# Altium project Digital_Optical_18Tx_14Tx4Rx_3vxx.PrjPCB
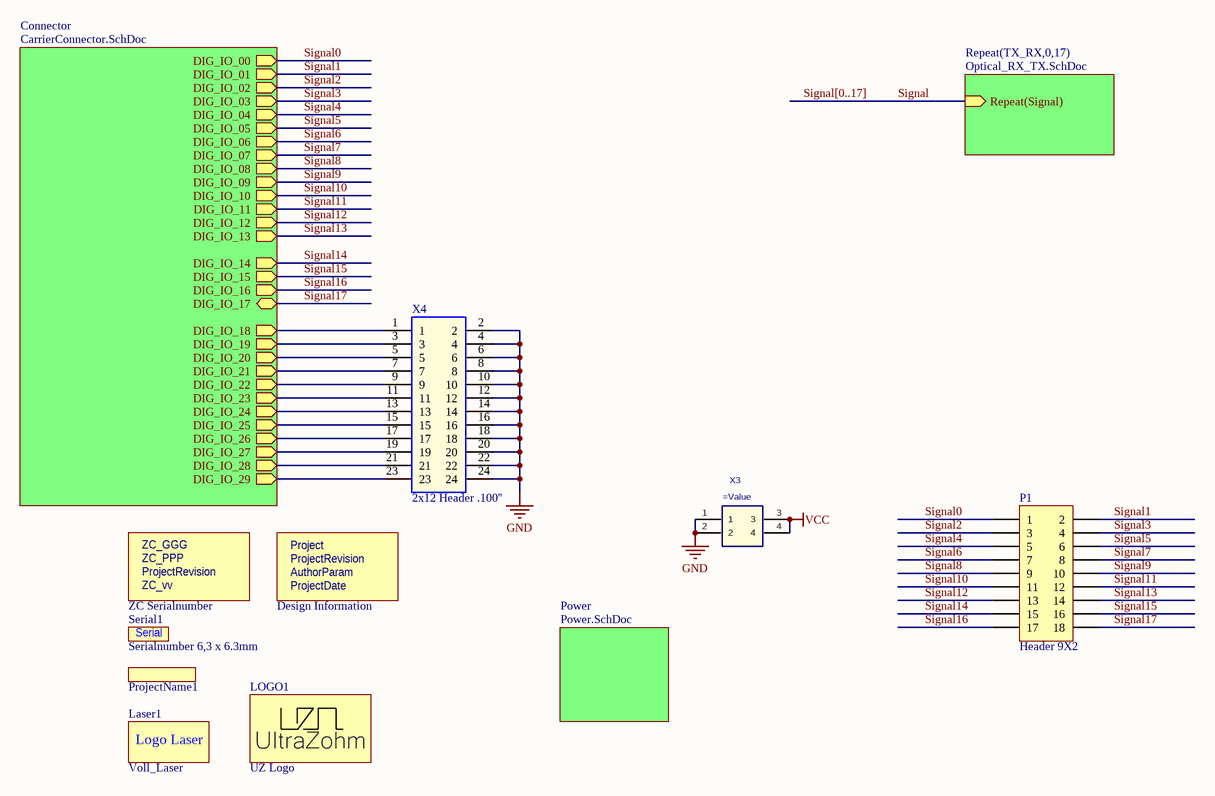
[diagram p0: TopSheet.SchDoc]
Author: T. Kreppel; Date: 04/20; ProjectName: Digital_Adapter_Optical_18Tx/14Tx_4Rx; ProjectRevision: 3v01
5 sheets, 66 parts. Net scope: hierarchical (ports join the sheet entries above them; power ports are global).
Board file: Digital_Optical_18Tx_14Tx4Rx_3vxx.PcbDoc
Sheets:
  TopSheet.SchDoc
    Power = Power.SchDoc
    Connector = CarrierConnector.SchDoc
  Optical_TX.SchDoc
  Optical_RX.SchDoc

## Sheet TopSheet.SchDoc
size A4; CompanyName: Technische Hochschule Nürnberg Georg Simon Ohm; Organization: UltraZohm; Address1: Kesslerplatz 12; Address2: 90489 Nürnberg; Address3: GERMANY; DocumentNumber: 1; SheetNumber: 1; SheetTotal: 5; Website: www.ultrazohm.com

### Parts
(Parts that share a designator on the sheet are numbered #1, #2 ... from top to bottom, then left to right.)
?#1  ZC Serialnumber  [ZC-Serial]  (no BOM)
?#2  Design Information  [Design_info2]  (no BOM)
Laser1  Voll_Laser  [Voll_Laser]  (no BOM)
LOGO1  UZ Logo  [UZ_Logo_small]  (no BOM)
P1  Header 9X2  [HDR2X9]
ProjectName1  Project Name, Rev  [ID_ProjectRev]  (value not drawn)  (no BOM)
Serial1  Serialnumber 6,3 x 6.3mm  [Serial_6.3x6.3mm]  (no BOM)
X3  (no value)  [IPL1-102-01-L-D-K]
X4  2x12 Header .100''  [TST-112-01-G-D]

### Sub-sheets
Connector = CarrierConnector.SchDoc: DIG_IO_05 (out), DIG_IO_09 (out), DIG_IO_01 (out), DIG_IO_07 (out), DIG_IO_08 (out), DIG_IO_06 (out), DIG_IO_04 (out), DIG_IO_16 (out), DIG_IO_12 (out), DIG_IO_15 (out), DIG_IO_02 (out), DIG_IO_03 (out), DIG_IO_11 (out), DIG_IO_14 (out), DIG_IO_13 (out), DIG_IO_10 (out), DIG_IO_27 (out), DIG_IO_26 (out), DIG_IO_17 (bidir), DIG_IO_19 (out), DIG_IO_29 (out), DIG_IO_24 (out), DIG_IO_22 (out), DIG_IO_28 (out), DIG_IO_21 (out), DIG_IO_23 (out), DIG_IO_25 (out), DIG_IO_18 (out), DIG_IO_20 (out), DIG_IO_00 (out)
Power = Power.SchDoc: no entries
Repeat(TX_RX,0,17) = Optical_RX_TX.SchDoc (file not in this document): Repeat(Signal) (in)

### Nets
GND: X3.1 X3.2 X4.2 X4.4 X4.6 X4.8 X4.10 X4.12 X4.14 X4.16 X4.18 X4.20 X4.22 X4.24
VCC: X3.3 X3.4
DIG_IO_18: X4.1 ; sheet Connector/DIG_IO_18
DIG_IO_19: X4.3 ; sheet Connector/DIG_IO_19
DIG_IO_20: X4.5 ; sheet Connector/DIG_IO_20
DIG_IO_21: X4.7 ; sheet Connector/DIG_IO_21
DIG_IO_22: X4.9 ; sheet Connector/DIG_IO_22
DIG_IO_23: X4.11 ; sheet Connector/DIG_IO_23
DIG_IO_24: X4.13 ; sheet Connector/DIG_IO_24
DIG_IO_25: X4.15 ; sheet Connector/DIG_IO_25
DIG_IO_26: X4.17 ; sheet Connector/DIG_IO_26
DIG_IO_27: X4.19 ; sheet Connector/DIG_IO_27
DIG_IO_28: X4.21 ; sheet Connector/DIG_IO_28
DIG_IO_29: X4.23 ; sheet Connector/DIG_IO_29
Signal: sheet Repeat(TX_RX,0,17)/Repeat(Signal)
Signal0: P1.1 ; sheet Connector/DIG_IO_00
Signal1: P1.2 ; sheet Connector/DIG_IO_01
Signal2: P1.3 ; sheet Connector/DIG_IO_02
Signal3: P1.4 ; sheet Connector/DIG_IO_03
Signal4: P1.5 ; sheet Connector/DIG_IO_04
Signal5: P1.6 ; sheet Connector/DIG_IO_05
Signal6: P1.7 ; sheet Connector/DIG_IO_06
Signal7: P1.8 ; sheet Connector/DIG_IO_07
Signal8: P1.9 ; sheet Connector/DIG_IO_08
Signal9: P1.10 ; sheet Connector/DIG_IO_09
Signal10: P1.11 ; sheet Connector/DIG_IO_10
Signal11: P1.12 ; sheet Connector/DIG_IO_11
Signal12: P1.13 ; sheet Connector/DIG_IO_12
Signal13: P1.14 ; sheet Connector/DIG_IO_13
Signal14: P1.15 ; sheet Connector/DIG_IO_14
Signal15: P1.16 ; sheet Connector/DIG_IO_15
Signal16: P1.17 ; sheet Connector/DIG_IO_16
Signal17: P1.18 ; sheet Connector/DIG_IO_17

### Buses and harness runs
bus Signal[0..17]

### Notes on the sheet
- Title
- Revision:
- Design Engineer:
- Date:
- Project:
- Sheet
- of
- (in symbol Design Information) Project; ProjectRevision; AuthorParam; ProjectDate
- (in symbol SerialNumber) Serial
- (in symbol Voll_Laser) Logo Laser
- (in symbol ZC-Serial) ZC_GGG; ZC_PPP; ProjectRevision; ZC_vv

### Library data of the parts
?#1 = ZC-Serial: Manufacturer: UltraZohm; Value: GGG-PPP-VVvv; Created from: FRosner; Manufacturer Part Number: ZC-Serial; PartID: 58; Created On: 15.04.2025 09:17:14; ComponentLink1Description: https://docs.ultrazohm.com/; ComponentLink1URL: homepage; Component Type: ZC Serialnumber; Last Updated: 15.04.2025 09:17:14; Supplier 1: -; Supplier Part Number 1: -; Type: Serial Number; Live Cycle Status: 1
?#2 = Design Information: Manufacturer: UltraZohm; Created from: MGremer; Manufacturer Part Number: Design Information; PartID: 12; Created On: 03.11.2021 09:04:23; ComponentLink1Description: https://docs.ultrazohm.com/; ComponentLink1URL: homepage; Component Type: Design Information; Last Updated: 15.04.2025 09:29:36; Supplier 1: -; Supplier Part Number 1: -; Type: Design Information; Value: Design Information; Live Cycle Status: 1
Laser1 = Voll_Laser: Logo Laser Warning Sign
LOGO1 = UZ Logo: UltraZohm Logo on PCB; Created: Jan2021_Liegmann; Value: UZ Logo
P1 = Header 9X2: Header, 9-Pin, Dual row; LatestRevisionDate: 17-Jul-2002; LatestRevisionNote: Re-released for DXP Platform.; Publisher: Altium Limited
ProjectName1 = ID_ProjectRev: Project Name and Revision Number; Created: 2018_11_23_AGeiger; Value: Project Name, Rev
Serial1 = SerialNumber: Created: 2018_09_18_AGeiger; Value: Serialnumber 6,3 x 6.3mm
X3 = IPL1-102-XX-X-D-X: 2.54mm Double Row Terminal Assembly, Right-Angled; Manufacturer: SAMTEC; Created: 2018_05_02_AGeiger; Value: =MPN; MPN: IPL1-102-01-L-D-K
X4 = TST-112-01-G-D: Double Row, 12 positions, Shrouded Terminal Header .100''; MF: Samtec; Created: 2020_04_Kreppel; MPN: TST-112-01-G-D; Supplier 1: Mouser; Supplier Part Number 1: 200-TST11201GD

## Sheet Power.SchDoc
size A4; CompanyName: Technische Hochschule Nürnberg Georg Simon Ohm; Organization: UltraZohm; Address1: Kesslerplatz 12; Address2: 90489 Nürnberg; Address3: GERMANY; DocumentNumber: 3; SheetNumber: 3; SheetTotal: 5; Website: www.ultrazohm.com
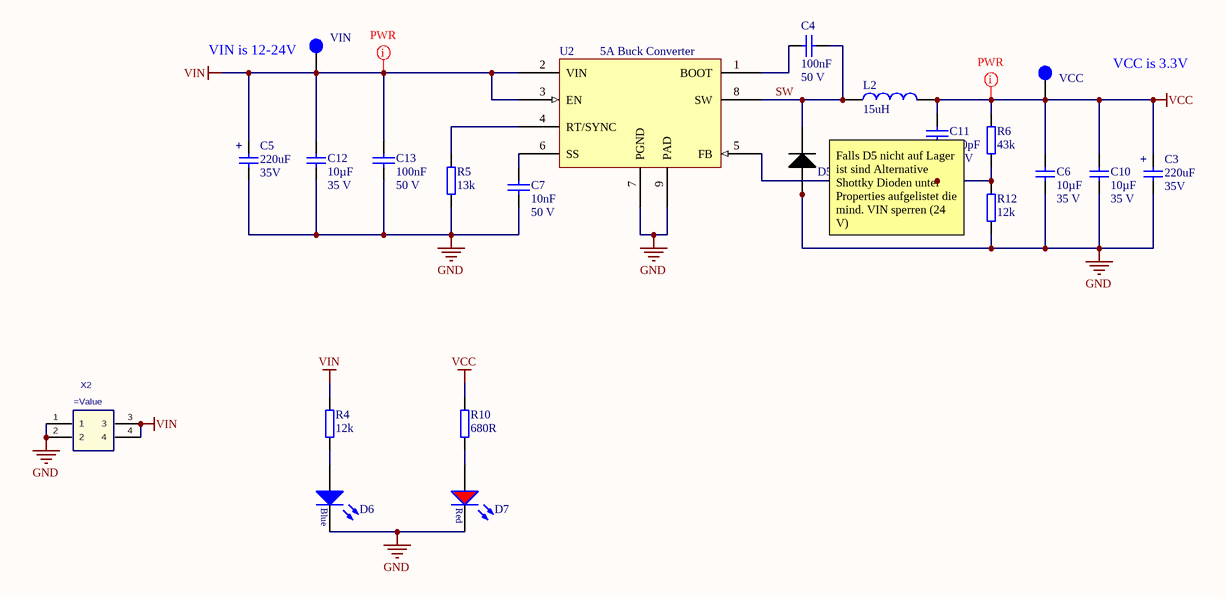
[diagram p1: Power.SchDoc]

### Parts
(Parts that share a designator on the sheet are numbered #1, #2 ... from top to bottom, then left to right.)
C3  220uF  Voltage: 35V  [CAPAE9083X105M]
C4  Rated Voltage: 50 V  [C_0603(1608)100_L]  (hidden comment: 100nF)
C5  220uF  Voltage: 35V  [CAPAE9083X105M]
C6  10µF  Voltage: 35 V  [C_1206]
C7  Rated Voltage: 50 V  [C_0603(1608)100_L]  (hidden comment: 10nF)
C10  10µF  Voltage: 35 V  [C_1206]
C11  Rated Voltage: 50 V  [C_0603(1608)100_L]  (hidden comment: 220pF)
C12  10µF  Voltage: 35 V  [C_1206]
C13  Rated Voltage: 50 V  [C_0603(1608)100_L]  (hidden comment: 100nF)
D5  (no value)  [DPAK254P1542X460-3N]
D6  150060BS75000  [WL-SMCW_0603]  (value not drawn)
D7  150060RS75000  [WL-SMCW_0603]  (value not drawn)
L2  15uH  [MWSA1004]
R4  12k  [R_0603_N]
R5  13k  [R_0603_N]
R6  43k  [R_0603_N]
R10  680R  [R_0603_N]
R12#1  12k  [R_0603_N]
U2  5A Buck Converter  [SOP127P600X170_HS-9N]
VCC  Testpoint 1mm  [TP_1mm]  (value not drawn)  (no BOM)
VIN  Testpoint 1mm  [TP_1mm]  (value not drawn)  (no BOM)
X2  (no value)  [IPL1-102-01-L-D-K]

### Nets
GND: C3.2 C5.2 C6.1 C7.2 C10.1 C12.1 C13.1 D5.1(A) D5.3(A) D6.1(K) D7.1(K) R5.1 R12#1.1 U2.7(PGND) U2.9(PAD) X2.1 X2.2
VCC: C3.1 C6.2 C10.2 C11.1 L2.2 R6.2 R10.2 VCC.1
VIN: C5.1 C12.2 C13.2 R4.2 U2.2(VIN) U2.3(EN) VIN.1 X2.3 X2.4
SW: C4.2 D5.4(K) L2.1 U2.8(SW)
NetC4_1: C4.1 U2.1(BOOT)
NetC7_1: C7.1 U2.6(SS)
NetC11_2: C11.2 R6.1 R12#1.2 U2.5(FB)
NetD6_2: D6.2(A) R4.1
NetD7_2: D7.2(A) R10.1
NetR5_2: R5.2 U2.4(RT/SYNC)

### Layout directives
mark named PWR: VCC, VIN

### Notes on the sheet
- (near VIN) VIN is 12-24V
- VCC is 3.3V
- (near C11) Falls D5 nicht auf Lager ist sind Alternative Shottky Dioden unter Properties aufgelistet die mind. VIN sperren (24 V)
- Title
- Revision:
- Design Engineer:
- Date:
- Project:
- Sheet
- of
- (in symbol C_ELKO_8x10) +

### Library data of the parts
C3 C5 = C_ELKO_8x10: ALUMINUM ELECTROLYTIC CAPACITOR; MPN: tbd; Tolerance: 20%; Package: 8x10; Value: 220uF; Created: 2018_06_25_AGeiger; Supplier Part Number 1: tbd; LCSC Part #: C311611; Dielectric: tbd; Supplier 1: tbd
C4 C7 C11 C13 = C_0603: CAP 0603 (1608 Metric) SMD; Tolerance: ±5%; Case-Metric: 1608; Case-EIA: 0603; Max Thickness: 1 mm; Technology: SMT; Created: 2018_09_06_AGeiger; Dielectric: *; Supplier 1: *; Supplier Part Number 1: *; MF: *; MPN: *; Package: 0603
  C4 C13: LCSC Part #: C14663; Value: 100nF
  C7: LCSC Part #: C57112; Value: 10nF
  C11: LCSC Part #: C1603; Value: 220pF
C6 C10 C12 = C_1206: Capacitor 1206; MPN: GMK316BJ106KL-T; Tolerance: 10%; MF: Taiyo Yuden; Dielectric: X5R; Package: 1206; Value: 10µF; Created: 2018_06_25_AGeiger; Supplier 1: Mouser; Supplier Part Number 1: 963-GMK316BJ106KL-T; LCSC Part #: C13585
D5 = STPS30L60CG-TR: SCHOTTKY BARRIER DIODES (SBD) TO-263-2 ROHS; ComponentLink1Description: Manufacturer; ComponentLink1URL: STMicroelectronics; ComponentLink2Description: Datasheet; LCSC Part # 4: C213442; LCSC Part # 2: C172486; LCSC Part # 3: C180216; LCSC Part #: C181026
D6 = LED_Blue_0603: WL-SMCW SMD Mono-color Chip LED Waterclear, size 0603, Blue, 3.2 V, 140°; Forward Voltage: 3.2 V; Luminous Intensity: 145 mcd; Peak Wavelength: 465 nm; Dominant Wavelength: 470 nm; MF: Wuerth Elektronik; Published Date: Sep. 2017; ComponentLink1Description: Manufacturer; ComponentLink1URL: http://www.we-online.de; ComponentLink2Description: Datasheet; ComponentLink2URL: http://katalog.we-online.com/led/datasheet/150060BS75000.pdf; MPN: 150060BS75000; Size: 0603; Viewing Angle: 140°; Emitting Color: Blue; Value: 150060BS75000; Package: 0603; Created: 2018_09_06_AGeiger; Supplier 1: Farnell; Supplier Part Number 1: 2322069; Supplier 2: Mouser; Supplier Part Number 2: 710-150060BS75000; Supplier 3: Digi-Key; Supplier Part Number 3: 732-4966-1-ND; LCSC Part #: C72041
D7 = LED_Red_0603: WL-SMCW SMD Mono-color Chip LED Waterclear, size 0603, Red, 2 V, 140°; Forward Voltage: 2 V; Luminous Intensity: 250 mcd; Peak Wavelength: 630 nm; Dominant Wavelength: 625 nm; MF: Wuerth Elektronik; Published Date: Sep. 2017; ComponentLink1Description: Manufacturer; ComponentLink1URL: http://www.we-online.de; ComponentLink2Description: Datasheet; ComponentLink2URL: http://katalog.we-online.com/led/datasheet/150060RS75000.pdf; MPN: 150060RS75000; Size: 0603; Viewing Angle: 140°; Emitting Color: Red; Value: 150060RS75000; Package: 0603; Created: 2018_09_06_AGeiger; Supplier 1: Farnell; Supplier Part Number 1: 2322071; Supplier 2: Mouser; Supplier Part Number 2: 710-150060RS75000; Supplier 3: Digi-Key; Supplier Part Number 3: 732-4978-1-ND; LCSC Part #: C2286
L2 = Inductor_2.2uH_13A: POWER INDUCTORS 2.2UH ±20% 13A SMD,10.5X11.5X4.0MM ROHS; Current rated: 6.25A; Value2: 2.2uH; LCSC Part2 #: C149550; Current rated2: 13A; LCSC Part #: C151872; Value: 15uH
R4-R6 R12#1 = R_0603_JLC: SMD Resistor 0603; Tolerance: 1%; Voltage: 50V; Power: 100 mW; Package: 0603; Created: 2018_09_06_AGeiger; Supplier 1: *; Supplier Part Number 1: *
  R4 R12#1: Value: 12k; LCSC Part #: C22790
  R5: Value: 13k; LCSC Part #: C22797
  R6: Value: 43k; LCSC Part #: C23172
R10 = R_0603: SMD Resistor 0603; MPN: CR0603-FX-3901ELF; Tolerance: 1%; Voltage: 75V; Power: 100 mW; MF: Bourns; Package: 0603; Value: 680R; Created: 2018_09_06_AGeiger; Supplier 1: Mouser; Supplier Part Number 1: 652-CR0603-FX3901ELF; LCSC Part #: C23228
U2 = LMR14050: SIMPLE SWITCHER® 40-V, 5-A, 2.2-MHz step-down converter with 40-μA IQr; MPN: LMR14050SDDAR; MF: Texas Instruments; fSW: 1 MHz; Created: 2020_04_Kreppel; Package: HSOIC-8; Supplier 1: Mouser; Supplier Part Number 1: 595-LMR14050SDDAR; LCSC Part #: C155484
VCC VIN = TP_1mm: Created: 2018_06_25_AGeiger; Value: Testpoint 1mm
X2 = IPL1-102-XX-X-D-X: as X3 on sheet TopSheet; Created: 2018_05_02_AGeiger; Value: =MPN; MPN: IPL1-102-01-L-D-K

## Sheet CarrierConnector.SchDoc
size A4; CompanyName: Technische Hochschule Nürnberg Georg Simon Ohm; Organization: UltraZohm; Address1: Kesslerplatz 12; Address2: 90489 Nürnberg; Address3: GERMANY; DocumentNumber: 2; SheetNumber: 2; SheetTotal: 5; Website: www.ultrazohm.com
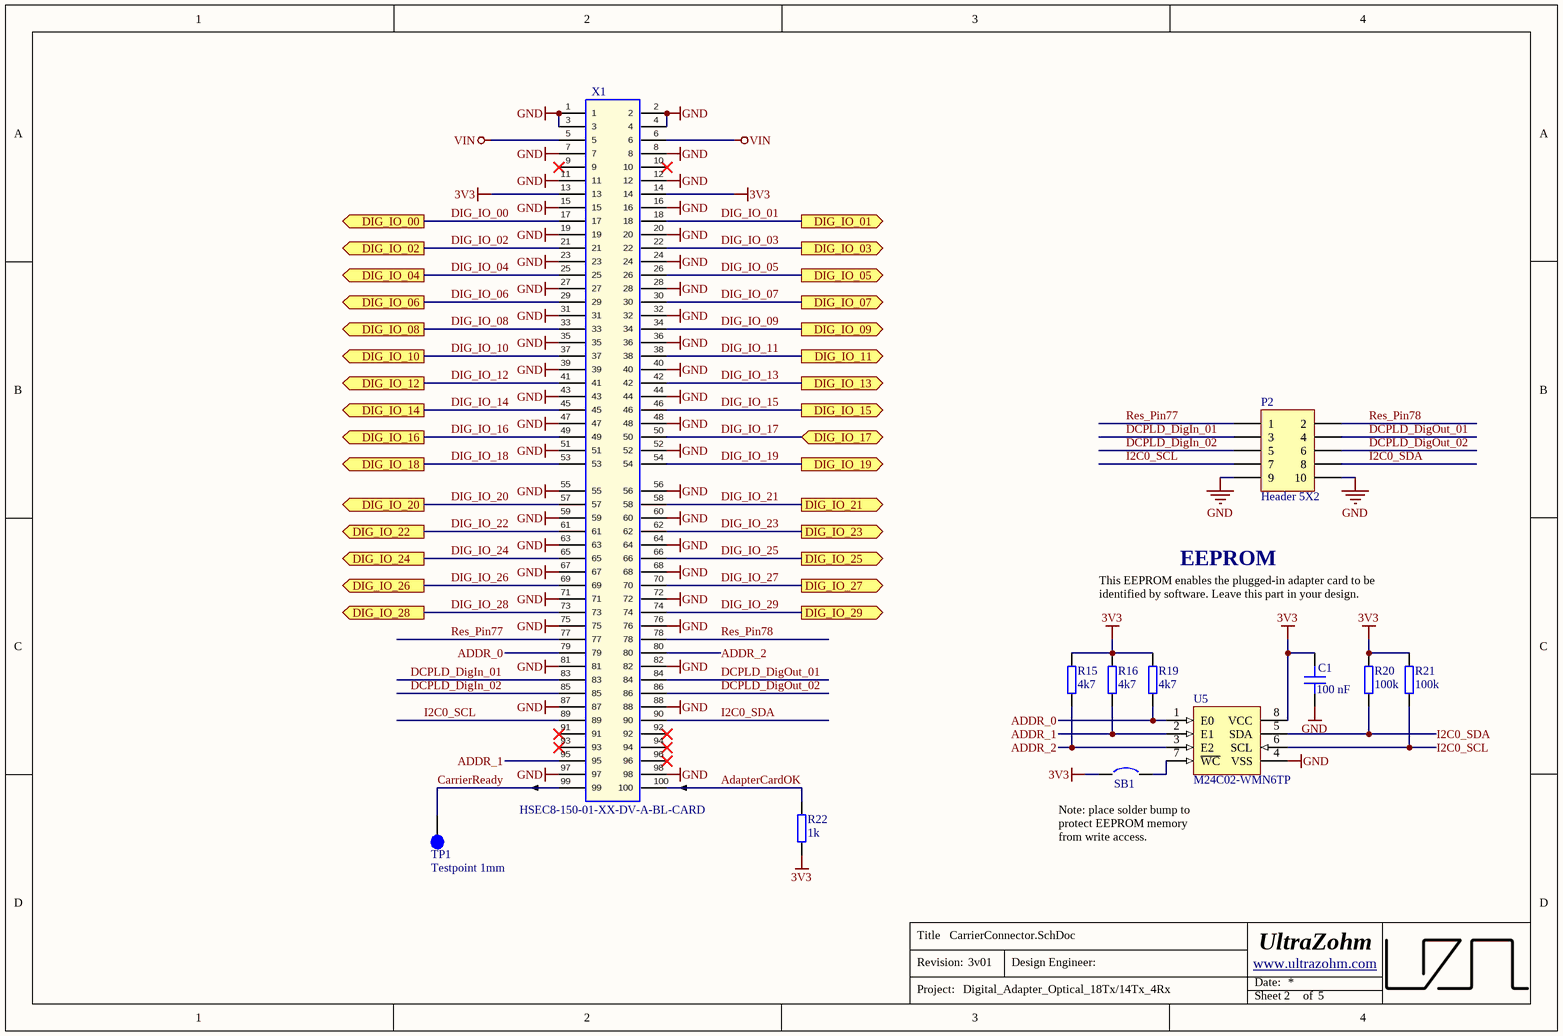
[diagram p2: CarrierConnector.SchDoc]

### Parts
(Parts that share a designator on the sheet are numbered #1, #2 ... from top to bottom, then left to right.)
C1#1  100 nF  [C_0603]
P2  Header 5X2  [HDR2X5]
R15  4k7  [RES 0603_1608]
R16  4k7  [RES 0603_1608]
R19  4k7  [RES 0603_1608]
R20  100k  [RES 0603_1608]
R21  100k  [RES 0603_1608]
R22  1k  [R_0603_TE]
SB1  Solder Bump 0603  [SB_0603]  (value not drawn)  (no BOM)
TP1  Testpoint 1mm  [TP_1mm]  (no BOM)
U5#1  M24C02-WMN6TP  [D0008A_N]
X1  HSEC8-150-01-XX-DV-A-BL-CARD  [HSEC8-150-01-XX-DV-A-BL-CARD]  (no BOM)

### Ports
DIG_IO_00 (out), DIG_IO_01 (out), DIG_IO_02 (out), DIG_IO_03 (out), DIG_IO_04 (out), DIG_IO_05 (out), DIG_IO_06 (out), DIG_IO_07 (out), DIG_IO_08 (out), DIG_IO_09 (out), DIG_IO_10 (out), DIG_IO_11 (out), DIG_IO_12 (out), DIG_IO_13 (out), DIG_IO_14 (out), DIG_IO_15 (out), DIG_IO_16 (out), DIG_IO_17 (bidir), DIG_IO_18 (out), DIG_IO_19 (out), DIG_IO_20 (out), DIG_IO_21 (out), DIG_IO_22 (out), DIG_IO_23 (out), DIG_IO_24 (out), DIG_IO_25 (out), DIG_IO_26 (out), DIG_IO_27 (out), DIG_IO_28 (out), DIG_IO_29 (out)

### Nets
3V3: C1#1.1 R15.2 R16.2 R19.2 R20.2 R21.2 R22.1 SB1.1 U5#1.8(VCC) X1.13 X1.14
GND: C1#1.2 P2.9 P2.10 U5#1.4(VSS) X1.1 X1.2 X1.3 X1.4 X1.7 X1.8 X1.11 X1.12 X1.15 X1.16 X1.19 X1.20 X1.23 X1.24 X1.27 X1.28 X1.31 X1.32 X1.35 X1.36 X1.39 X1.40 X1.43 X1.44 X1.47 X1.48 X1.51 X1.52 X1.55 X1.56 X1.59 X1.60 X1.63 X1.64 X1.67 X1.68 X1.71 X1.72 X1.75 X1.76 X1.81 X1.82 X1.87 X1.88 X1.97 X1.98
VIN: X1.5 X1.6
AdapterCardOK: R22.2 X1.100
ADDR_0: R19.1 U5#1.1(E0) X1.79
ADDR_1: R16.1 U5#1.2(E1) X1.95
ADDR_2: R15.1 U5#1.3(E2) X1.80
CarrierReady: TP1.1 X1.99
DCPLD_DigIn_01: P2.3 X1.83
DCPLD_DigIn_02: P2.5 X1.85
DCPLD_DigOut_01: P2.4 X1.84
DCPLD_DigOut_02: P2.6 X1.86
DIG_IO_00: X1.17 ; port DIG_IO_00  [project net Signal0]
DIG_IO_01: X1.18 ; port DIG_IO_01  [project net Signal1]
DIG_IO_02: X1.21 ; port DIG_IO_02  [project net Signal2]
DIG_IO_03: X1.22 ; port DIG_IO_03  [project net Signal3]
DIG_IO_04: X1.25 ; port DIG_IO_04  [project net Signal4]
DIG_IO_05: X1.26 ; port DIG_IO_05  [project net Signal5]
DIG_IO_06: X1.29 ; port DIG_IO_06  [project net Signal6]
DIG_IO_07: X1.30 ; port DIG_IO_07  [project net Signal7]
DIG_IO_08: X1.33 ; port DIG_IO_08  [project net Signal8]
DIG_IO_09: X1.34 ; port DIG_IO_09  [project net Signal9]
DIG_IO_10: X1.37 ; port DIG_IO_10  [project net Signal10]
DIG_IO_11: X1.38 ; port DIG_IO_11  [project net Signal11]
DIG_IO_12: X1.41 ; port DIG_IO_12  [project net Signal12]
DIG_IO_13: X1.42 ; port DIG_IO_13  [project net Signal13]
DIG_IO_14: X1.45 ; port DIG_IO_14  [project net Signal14]
DIG_IO_15: X1.46 ; port DIG_IO_15  [project net Signal15]
DIG_IO_16: X1.49 ; port DIG_IO_16  [project net Signal16]
DIG_IO_17: X1.50 ; port DIG_IO_17  [project net Signal17]
DIG_IO_18: X1.53 ; port DIG_IO_18
DIG_IO_19: X1.54 ; port DIG_IO_19
DIG_IO_20: X1.57 ; port DIG_IO_20
DIG_IO_21: X1.58 ; port DIG_IO_21
DIG_IO_22: X1.61 ; port DIG_IO_22
DIG_IO_23: X1.62 ; port DIG_IO_23
DIG_IO_24: X1.65 ; port DIG_IO_24
DIG_IO_25: X1.66 ; port DIG_IO_25
DIG_IO_26: X1.69 ; port DIG_IO_26
DIG_IO_27: X1.70 ; port DIG_IO_27
DIG_IO_28: X1.73 ; port DIG_IO_28
DIG_IO_29: X1.74 ; port DIG_IO_29
I2C0_SCL: P2.7 R21.1 U5#1.6(SCL) X1.89
I2C0_SDA: P2.8 R20.1 U5#1.5(SDA) X1.90
Res_Pin77: P2.1 X1.77
Res_Pin78: P2.2 X1.78
NetSB1_2: SB1.2 U5#1.7(~{WC})

Not connected (* = marked no-connect by the designer): X1 9* 10* 91* 92* 93* 94* 96*

### Notes on the sheet
- EEPROM
- This EEPROM enables the plugged-in adapter card to be identified by software. Leave this part in your design.
- Note: place solder bump to protect EEPROM memory from write access.
- Title
- Revision:
- Design Engineer:
- Date:
- Project:
- Sheet
- of

### Library data of the parts
C1#1 = C0603C104K9PACTU: Capacitor 0603, 6.3 VDC, 100 nF, X5R; Manufacturer: KEMET; Tolerance: 10 %; Voltage Rating: 6.3 VDC; Created from: MGremer; Manufacturer Part Number: C0603C104K9PACTU; PartID: 70; Created On: 20.12.2020 13:54:13; ComponentLink1Description: Datasheet; ComponentLink1URL: https://www.mouser.de/datasheet/2/212/KEM_C1006_X5R_SMD-1103249.pdf; Component Type: Capacitor 0603; Device Package: 0603; Last Updated: 20.01.2021 13:57:36; Mounting Type: SMD; Operating Temperature: -55 - 85°C; Series: SMD Comm X5R; Supplier 1: Mouser; Supplier Part Number 1: 80-C0603C104K9P; Type: Capacitor; Value: 100 nF; Live Cycle Status: 1; Stock number: not stored
P2 = Header 5X2: Header, 5-Pin, Dual row; LatestRevisionDate: 17-Jul-2002; LatestRevisionNote: Re-released for DXP Platform.; Publisher: Altium Limited
R15 R16 R19 = 0603WAF4701T5E: SMD resistor E24 series; Manufacturer: UNI-ROYAL; Tolerance: 1%; Created from: AGeiger; Manufacturer Part Number: 0603WAF4701T5E; PartID: 90; Created On: 14.12.2020 16:17:14; ComponentLink1Description: Datasheet; ComponentLink1URL: https://datasheet.lcsc.com/lcsc/2206010116_UNI-ROYAL-Uniroyal-Elec-0603WAF4701T5E_C23162.pdf; Component Type: SMD resistor; Device Package: 0603; Last Updated: 25.08.2022 20:03:04; Mounting Type: SMD; Supplier 1: LCSC; Supplier Part Number 1: C23162; Type: Resistor; Value: 4k7; Live Cycle Status: 1; Stock number: Labor SMD Container; LCSC Part Number: C23162
R20 R21 = RK73B1JTTD104J: SMD resistor E24 series; Manufacturer: KOA Speer; Tolerance: 5%; Created from: MGremer; Manufacturer Part Number: RK73B1JTTD104J; PartID: 122; Created On: 14.12.2020 16:17:14; ComponentLink1Description: Datasheet; ComponentLink1URL: https://www.mouser.de/datasheet/2/219/RK73B-1825463.pdf; Component Type: SMD resistor; Device Package: 0603; Last Updated: 27.05.2022 14:04:10; Mounting Type: SMD; Supplier 1: Mouser; Supplier Part Number 1: 660-RK73B1JTTD104J; Type: Resistor; Value: 100k; Live Cycle Status: 1; Stock number: Labor SMD Container; LCSC Part Number: C25803
R22 = UZgen_R_0603_1k: Generic resistor; Manufacturer: UZgen; Tolerance: 1 %; Created from: UZgenTool; Manufacturer Part Number: UZgen_R_0603_1k; PartID: 221; Created On: 02.07.2024 17:29:49; Value: 1k; Device Package: 0603; Mounting Type: SMD; Last Updated: 02.07.2024 17:29:49
SB1 = =Value: Created from: AGeiger; Revision: July-2002: Re-released for DXP Platform.; PartID: 1; Created On: 09.01.2024 17:13:56; Component Type: Solder Bump; Device Package: 0603; Last Updated: 09.01.2024 17:13:56; Manufacturer Part Number: Solder Bump 0603; Mounting Type: SMD; Value: Solder Bump 0603
TP1 = NULL: Manufacturer Part Number: NULL; Created from: AGeiger; Created: 2018_06_25_AGeiger; Value: Testpoint 1mm; PartID: 9; Created On: 20.09.2022 13:14:57; Component Type: Testpoint; Last Updated: 20.09.2022 13:15:39; Manufacturer: NULL; Supplier 1: NULL; Supplier Part Number 1: NULL; Type: Testpoint; Live Cycle Status: 1
U5#1 = M24C02-WMN6TP: 2Kbit I2C SOP-8 EEPROM ROHS; Manufacturer: STMicroelectronics; Created from: AGeiger; Manufacturer Part Number: M24C02-WMN6TP; PartID: 1; Created On: 19.11.2023 14:54:27; ComponentLink1Description: Datasheet; ComponentLink1URL: https://www.st.com/resource/en/datasheet/m24c01-w.pdf; Component Type: EEPROM; Device Package: SOIC-8; Last Updated: 19.11.2023 21:39:04; Mounting Type: SMD; Operating Temperature: -40 to +85 °C; Series: M24xxx; Supplier 1: Mouser; Supplier Part Number 1: 511-M24C02-WMN6TP; Supplier 2: LCSC; Supplier Part Number 2: C7562; Type: Memory; Value: M24C02-WMN6TP; LCSC Part Number: C7562
X1 = HSEC8-150-01-XX-DV-A-BL-CARD: Mating Card Layout for HSEC8-150-01-XX-DV-A-BL; Manufacturer: SAMTEC; Created: 2018_04_23_AGeiger; Value: HSEC8-150-01-XX-DV-A-BL-CARD

## Sheet Optical_TX.SchDoc
size A4; CompanyName: Technische Hochschule Nürnberg Georg Simon Ohm; Organization: UltraZohm; Address1: Kesslerplatz 12; Address2: 90489 Nürnberg; Address3: GERMANY; DocumentNumber: 4; SheetNumber: 4; SheetTotal: 5; Website: www.ultrazohm.com
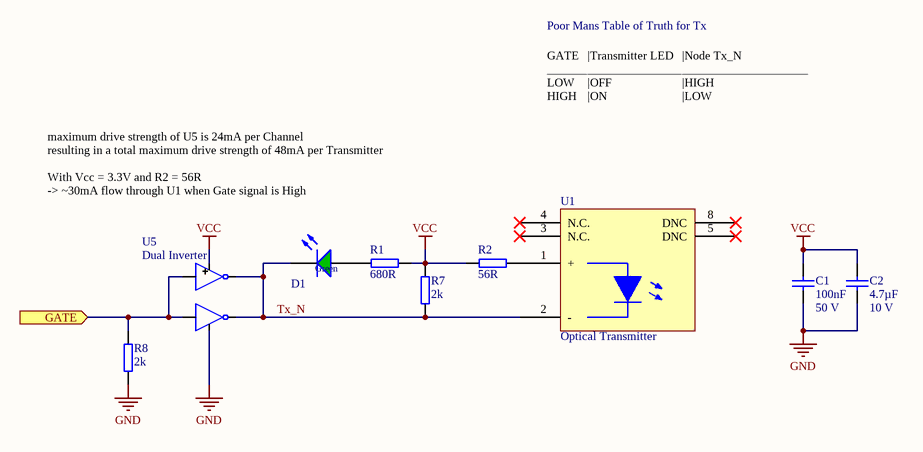
[diagram p3: Optical_TX.SchDoc]

### Parts
(Parts that share a designator on the sheet are numbered #1, #2 ... from top to bottom, then left to right.)
C1#2  Rated Voltage: 50 V  [C_0603(1608)100_L]  (hidden comment: 100nF)
C2  Voltage: 10 V  [CAP_2012X06N]  (hidden comment: 4.7µF)
D1  150060GS75000  [WL-SMCW_0603]  (value not drawn)
R1  680R  [R_0603_N]
R2  56R  [RES_2012X06N]
R7  2k  [R_0603_N]
R8  2k  [R_0603_N]
U1  Optical Transmitter  [HFBRx5XX]
U5#2  Dual Inverter  [SN74LVC2GU04DCKR]

### Ports
GATE (in)

### Nets
GND: C1#2.2 C2.2 R8.1 U5#2.2(GND)
VCC: C1#2.1 C2.1 R1.2 R2.1 R7.2 U5#2.5(VCC)
Tx_N: D1.1(K) R7.1 U1.2(-) U5#2.4(OUT2) U5#2.6(OUT2)
NetD1_2: D1.2(A) R1.1
NetR2_2: R2.2 U1.1(+)
NetR8_2: R8.2 U5#2.1(IN1) U5#2.3(IN2) ; port GATE

Not connected (* = marked no-connect by the designer): U1 3(N.C.)* 4(N.C.)* 5(DNC)* 8(DNC)*

### Notes on the sheet
- Poor Mans Table of Truth for Tx
- GATE
  _______
  LOW
  HIGH
- |Transmitter LED
  ___________________
  |OFF
  |ON
- |Node Tx_N
  _____________________
  |HIGH
  |LOW
- maximum drive strength of U5 is 24mA per Channel
  resulting in a total maximum drive strength of 48mA per Transmitter
  With Vcc = 3.3V and R2 = 56R
  -> ~30mA flow through U1 when Gate signal is High
- Title
- Revision:
- Design Engineer:
- Date:
- Project:
- Sheet
- of

### Library data of the parts
C1#2 = C_0603: as C4 on sheet Power; Max Thickness: 1 mm; Technology: SMT; Created: 2018_09_06_AGeiger; Dielectric: *; Supplier 1: *; Supplier Part Number 1: *; MF: *; MPN: *; Value: 100nF; Package: 0603; LCSC Part #: C14663
C2 = C_0805: CAP 0805 (2012 Metric) SMD; MPN: LMF212B7475KGHT; Tolerance: ±10%; Case-Metric: 2012; Dielectric: X7R; MF: Taiyo Yuden; Case-EIA: 0805; Max Thickness: 1 mm; Technology: SMT; Created: 2018_09_06_AGeiger; Supplier 1: Mouser; Supplier Part Number 1: 963-LMF212B7475KGHT; Value: 4.7µF; Package: 0805; LCSC Part #: C1779
D1 = LED_Green_0603: WL-SMCW SMD Mono-color Chip LED Waterclear, size 0603, Green, 3.2 V, 140°; Forward Voltage: 3.2 V; Luminous Intensity: 430 mcd; Peak Wavelength: 515 nm; Dominant Wavelength: 520 nm; MF: Wuerth Elektronik; Published Date: Sep. 2017; ComponentLink1Description: Manufacturer; ComponentLink1URL: http://www.we-online.de; ComponentLink2Description: Datasheet; ComponentLink2URL: http://katalog.we-online.com/led/datasheet/150060GS75000.pdf; MPN: 150060GS75000; Size: 0603; Viewing Angle: 140°; Emitting Color: Green; Value: 150060GS75000; Package: 0603; Created: 2018_09_06_AGeiger; Supplier 1: Farnell; Supplier Part Number 1: 2322070; Supplier 2: Mouser; Supplier Part Number 2: 710-150060GS75000; Supplier 3: Digi-Key; Supplier Part Number 3: 732-4971-1-ND; LCSC Part #: C72043
R1 = R_0603: as R10 on sheet Power; Package: 0603; Value: 680R; Created: 2018_09_06_AGeiger; Supplier 1: Mouser; Supplier Part Number 1: 652-CR0603-FX3901ELF; LCSC Part #: C23228
R2 = R_0805: SMD Resistor 0805; Case_EIA: 0805; MF: Bourns; Voltage: 150 V; Power: 125 mW; Tolerance: 1%; Value: 56R; Supplier 1: Mouser; LCSC Part #: C17757
R7 R8 = R_0603: SMD Resistor 0603; MPN: RC0603FR-072KL; Tolerance: 1%; Voltage: 75 V; Power: 100 mW; MF: Yageo; Package: 0603; Value: 2k; Created: 2018_09_06_AGeiger; Supplier 1: Mouser; Supplier Part Number 1: 603-RC0603FR-072KL; LCSC Part #: C22975
U1 = HFBR-1521Z: Fibre Optic Transmitters, Link Horiz 5MBd Tx RoHS; MF: Broadcom/Avago; Wavelength: 660 nm; Foreward Current: 60 mA; Supply Voltage: 5V; Created: 2019_04_09_Kreppel; MPN: HFBR-1521Z; Data Rate: 5 MBd; Supplier 1: Mouser; Supplier 2: Digi-Key; Supplier Part Number 1: 630-HFBR-1521Z; Supplier Part Number 2: 516-2043-ND
U5#2 = SN74LVC2GU04DCKR: This dual inverter is designed for 1.65-V to 5.5-V VCC / operation.; LCSC Part #: C116660; JLCSMT Rotation: 180

## Sheet Optical_RX.SchDoc
size A4; CompanyName: Technische Hochschule Nürnberg Georg Simon Ohm; Organization: UltraZohm; Address1: Kesslerplatz 12; Address2: 90489 Nürnberg; Address3: GERMANY; DocumentNumber: 5; SheetNumber: 5; SheetTotal: 5; Website: www.ultrazohm.com
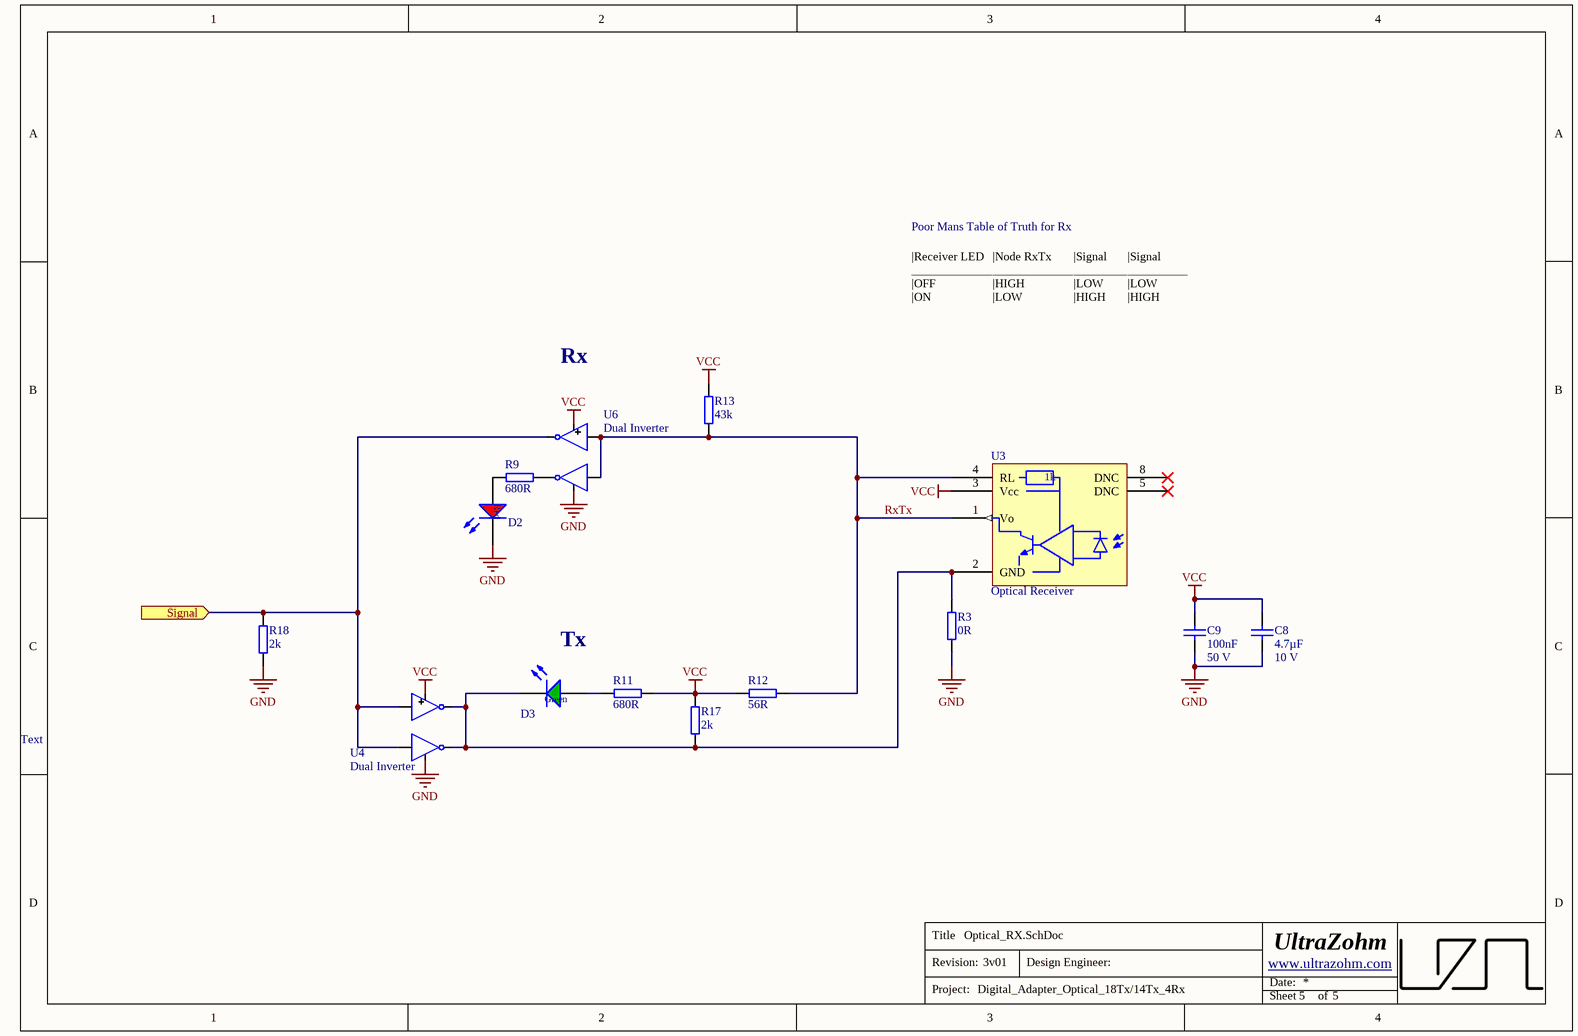
[diagram p4: Optical_RX.SchDoc]

### Parts
(Parts that share a designator on the sheet are numbered #1, #2 ... from top to bottom, then left to right.)
C8  Voltage: 10 V  [CAP_2012X06N]  (hidden comment: 4.7µF)
C9  Rated Voltage: 50 V  [C_0603(1608)100_L]  (hidden comment: 100nF)
D2  150060RS75000  [WL-SMCW_0603]  (value not drawn)
D3  150060GS75000  [WL-SMCW_0603]  (value not drawn)
R3  0R  [R_0603_N]
R9  680R  [R_0603_N]
R11  680R  [R_0603_N]
R12#2  56R  [RES_2012X06N]
R13  43k  [R_0603_N]
R17  2k  [R_0603_N]
R18  2k  [R_0603_N]
U3  Optical Receiver  [HFBRx5XX]
U4  Dual Inverter  [SN74LVC2GU04DCKR]
U6  Dual Inverter  [SN74LVC2GU04DCKR]

### Ports
Signal (in)

### Nets
GND: C8.2 C9.2 D2.1(K) R3.2 R18.1 U4.2(GND) U6.2(GND)
VCC: C8.1 C9.1 R11.1 R12#2.1 R13.1 R17.2 U3.3(Vcc) U4.5(VCC) U6.5(VCC)
RxTx: R12#2.2 R13.2 U3.1(Vo) U3.4(RL) U6.1(IN1) U6.3(IN2)
NetD2_2: D2.2(A) R9.2
NetD3_1: D3.1(K) R3.1 R17.1 U3.2(GND) U4.4(OUT2) U4.6(OUT2)
NetD3_2: D3.2(A) R11.2
NetR9_1: R9.1 U6.4(OUT2)
NetR18_2: R18.2 U4.1(IN1) U4.3(IN2) U6.6(OUT2) ; port Signal

Not connected (* = marked no-connect by the designer): U3 5(DNC)* 8(DNC)*

### Notes on the sheet
- Poor Mans Table of Truth for Rx
- |Receiver LED
  ________________
  |OFF
  |ON
- |Node RxTx
  _________________
  |HIGH
  |LOW
- |Signal
  _______________
  |LOW
  |HIGH
- GATE
  _______
  LOW
  HIGH
- |Signal
  __________
  |LOW
  |HIGH
- Rx
- Tx
- Text
- Title
- Revision:
- Design Engineer:
- Date:
- Project:
- Sheet
- of
- (in symbol HFBR-2528Z) 1k

### Library data of the parts
C8 = C_0805: as C2 on sheet Optical_TX; Max Thickness: 1 mm; Technology: SMT; Created: 2018_09_06_AGeiger; Supplier 1: Mouser; Supplier Part Number 1: 963-LMF212B7475KGHT; Value: 4.7µF; Package: 0805; LCSC Part #: C1779
C9 = C_0603: as C4 on sheet Power; Max Thickness: 1 mm; Technology: SMT; Created: 2018_09_06_AGeiger; Dielectric: *; Supplier 1: *; Supplier Part Number 1: *; MF: *; MPN: *; Value: 100nF; Package: 0603; LCSC Part #: C14663
D2 = LED_Red_0603: as D7 on sheet Power; Published Date: Sep. 2017; ComponentLink1Description: Manufacturer; ComponentLink1URL: http://www.we-online.de; ComponentLink2Description: Datasheet; ComponentLink2URL: http://katalog.we-online.com/led/datasheet/150060RS75000.pdf; MPN: 150060RS75000; Size: 0603; Viewing Angle: 140°; Emitting Color: Red; Value: 150060RS75000; Package: 0603; Created: 2018_09_06_AGeiger; Supplier 1: Farnell; Supplier Part Number 1: 2322071; Supplier 2: Mouser; Supplier Part Number 2: 710-150060RS75000; Supplier 3: Digi-Key; Supplier Part Number 3: 732-4978-1-ND; LCSC Part #: C2286
D3 = LED_Green_0603: as D1 on sheet Optical_TX; Published Date: Sep. 2017; ComponentLink1Description: Manufacturer; ComponentLink1URL: http://www.we-online.de; ComponentLink2Description: Datasheet; ComponentLink2URL: http://katalog.we-online.com/led/datasheet/150060GS75000.pdf; MPN: 150060GS75000; Size: 0603; Viewing Angle: 140°; Emitting Color: Green; Value: 150060GS75000; Package: 0603; Created: 2018_09_06_AGeiger; Supplier 1: Farnell; Supplier Part Number 1: 2322070; Supplier 2: Mouser; Supplier Part Number 2: 710-150060GS75000; Supplier 3: Digi-Key; Supplier Part Number 3: 732-4971-1-ND; LCSC Part #: C72043
R3 = R_0603: SMD Resistor 0603; MPN: CRCW06030000Z0EBC; Tolerance: 1%; Voltage: 75V; Power: 100 mW; MF: Vishay; Package: 0603; Value: 0R; Created: 2018_09_06_AGeiger; Supplier 1: Mouser; Supplier Part Number 1: 71-CRCW06030000Z0EBC; LCSC Part #: C21189
R9 R11 = R_0603: as R10 on sheet Power; Package: 0603; Value: 680R; Created: 2018_09_06_AGeiger; Supplier 1: Mouser; Supplier Part Number 1: 652-CR0603-FX3901ELF; LCSC Part #: C23228
R12#2 = R_0805: SMD Resistor 0805; MPN: CR0805-FX-1200ELF; Case_EIA: 0805; MF: Bourns; Voltage: 150 V; Power: 125 mW; Tolerance: 1%; Value: 56R; Supplier 1: Mouser; Supplier Part Number 1: 652-CR0805FX-1200ELF*; LCSC Part #: C17437
R13 = R_0603_JLC: as R4 on sheet Power; Package: 0603; Value: 43k; Created: 2018_09_06_AGeiger; Supplier 1: *; Supplier Part Number 1: *; LCSC Part #: C23172
R17 R18 = R_0603: as R7 on sheet Optical_TX; Package: 0603; Value: 2k; Created: 2018_09_06_AGeiger; Supplier 1: Mouser; Supplier Part Number 1: 603-RC0603FR-072KL; LCSC Part #: C22975
U3 = HFBR-2528Z: Fibre Optic Receivers, LINK HORIZ 5MBd RC VR RoHS; MPN: HFBR-2521Z; Suppier Part Number 2: 516-2062-ND; MF: Boadcom/Avago; Wavelength: 660 nm; Iout max: 25 mA; Supply Voltage: 5V; Created: 2019_04_09_Kreppel; Data Rate: 5 MBd; Supplier 1: Mouser; Supplier 2: Digi-Key; Supplier Part Number 1: 630-HFBR-2521Z
U4 U6 = SN74LVC2GU04DCKR: as U5#2 on sheet Optical_TX; LCSC Part #: C116660; JLCSMT Rotation: 180

## Nets that join several sheets
GND: TopSheet (14 pins), Power (17 pins), CarrierConnector (50 pins), Optical_TX (C1#2.2 C2.2 R8.1 U5#2.2), Optical_RX (7 pins)
VCC: TopSheet (X3.3 X3.4), Power (8 pins), Optical_TX (6 pins), Optical_RX (9 pins)
VIN: Power (9 pins), CarrierConnector (X1.5 X1.6)
DIG_IO_18: TopSheet (X4.1), CarrierConnector (X1.53)
DIG_IO_19: TopSheet (X4.3), CarrierConnector (X1.54)
DIG_IO_20: TopSheet (X4.5), CarrierConnector (X1.57)
DIG_IO_21: TopSheet (X4.7), CarrierConnector (X1.58)
DIG_IO_22: TopSheet (X4.9), CarrierConnector (X1.61)
DIG_IO_23: TopSheet (X4.11), CarrierConnector (X1.62)
DIG_IO_24: TopSheet (X4.13), CarrierConnector (X1.65)
DIG_IO_25: TopSheet (X4.15), CarrierConnector (X1.66)
DIG_IO_26: TopSheet (X4.17), CarrierConnector (X1.69)
DIG_IO_27: TopSheet (X4.19), CarrierConnector (X1.70)
DIG_IO_28: TopSheet (X4.21), CarrierConnector (X1.73)
DIG_IO_29: TopSheet (X4.23), CarrierConnector (X1.74)
Signal0: TopSheet (P1.1), CarrierConnector (X1.17)
Signal1: TopSheet (P1.2), CarrierConnector (X1.18)
Signal2: TopSheet (P1.3), CarrierConnector (X1.21)
Signal3: TopSheet (P1.4), CarrierConnector (X1.22)
Signal4: TopSheet (P1.5), CarrierConnector (X1.25)
Signal5: TopSheet (P1.6), CarrierConnector (X1.26)
Signal6: TopSheet (P1.7), CarrierConnector (X1.29)
Signal7: TopSheet (P1.8), CarrierConnector (X1.30)
Signal8: TopSheet (P1.9), CarrierConnector (X1.33)
Signal9: TopSheet (P1.10), CarrierConnector (X1.34)
Signal10: TopSheet (P1.11), CarrierConnector (X1.37)
Signal11: TopSheet (P1.12), CarrierConnector (X1.38)
Signal12: TopSheet (P1.13), CarrierConnector (X1.41)
Signal13: TopSheet (P1.14), CarrierConnector (X1.42)
Signal14: TopSheet (P1.15), CarrierConnector (X1.45)
Signal15: TopSheet (P1.16), CarrierConnector (X1.46)
Signal16: TopSheet (P1.17), CarrierConnector (X1.49)
Signal17: TopSheet (P1.18), CarrierConnector (X1.50)

## Assembly variants
18Tx: not fitted P1 P2 R14A R14B R16 R26A R26B X2 X3 X4
14Tx4Rx: not fitted P1 P2 R13A R13B R16 R19A R19B R23A R23B R24A R24B X2; alternate parts U5A -> HFBR-2528Z, U3B -> HFBR-2528Z, U3A -> HFBR-2528Z, U5B -> HFBR-2528Z, R21A -> R_config_down, R21B -> R_config_down, R25B -> R_config_down, R25A -> R_config_down